# EAGLE schematic sd2snes20 (EAGLE 4.15)

## Sheet 1 of 5
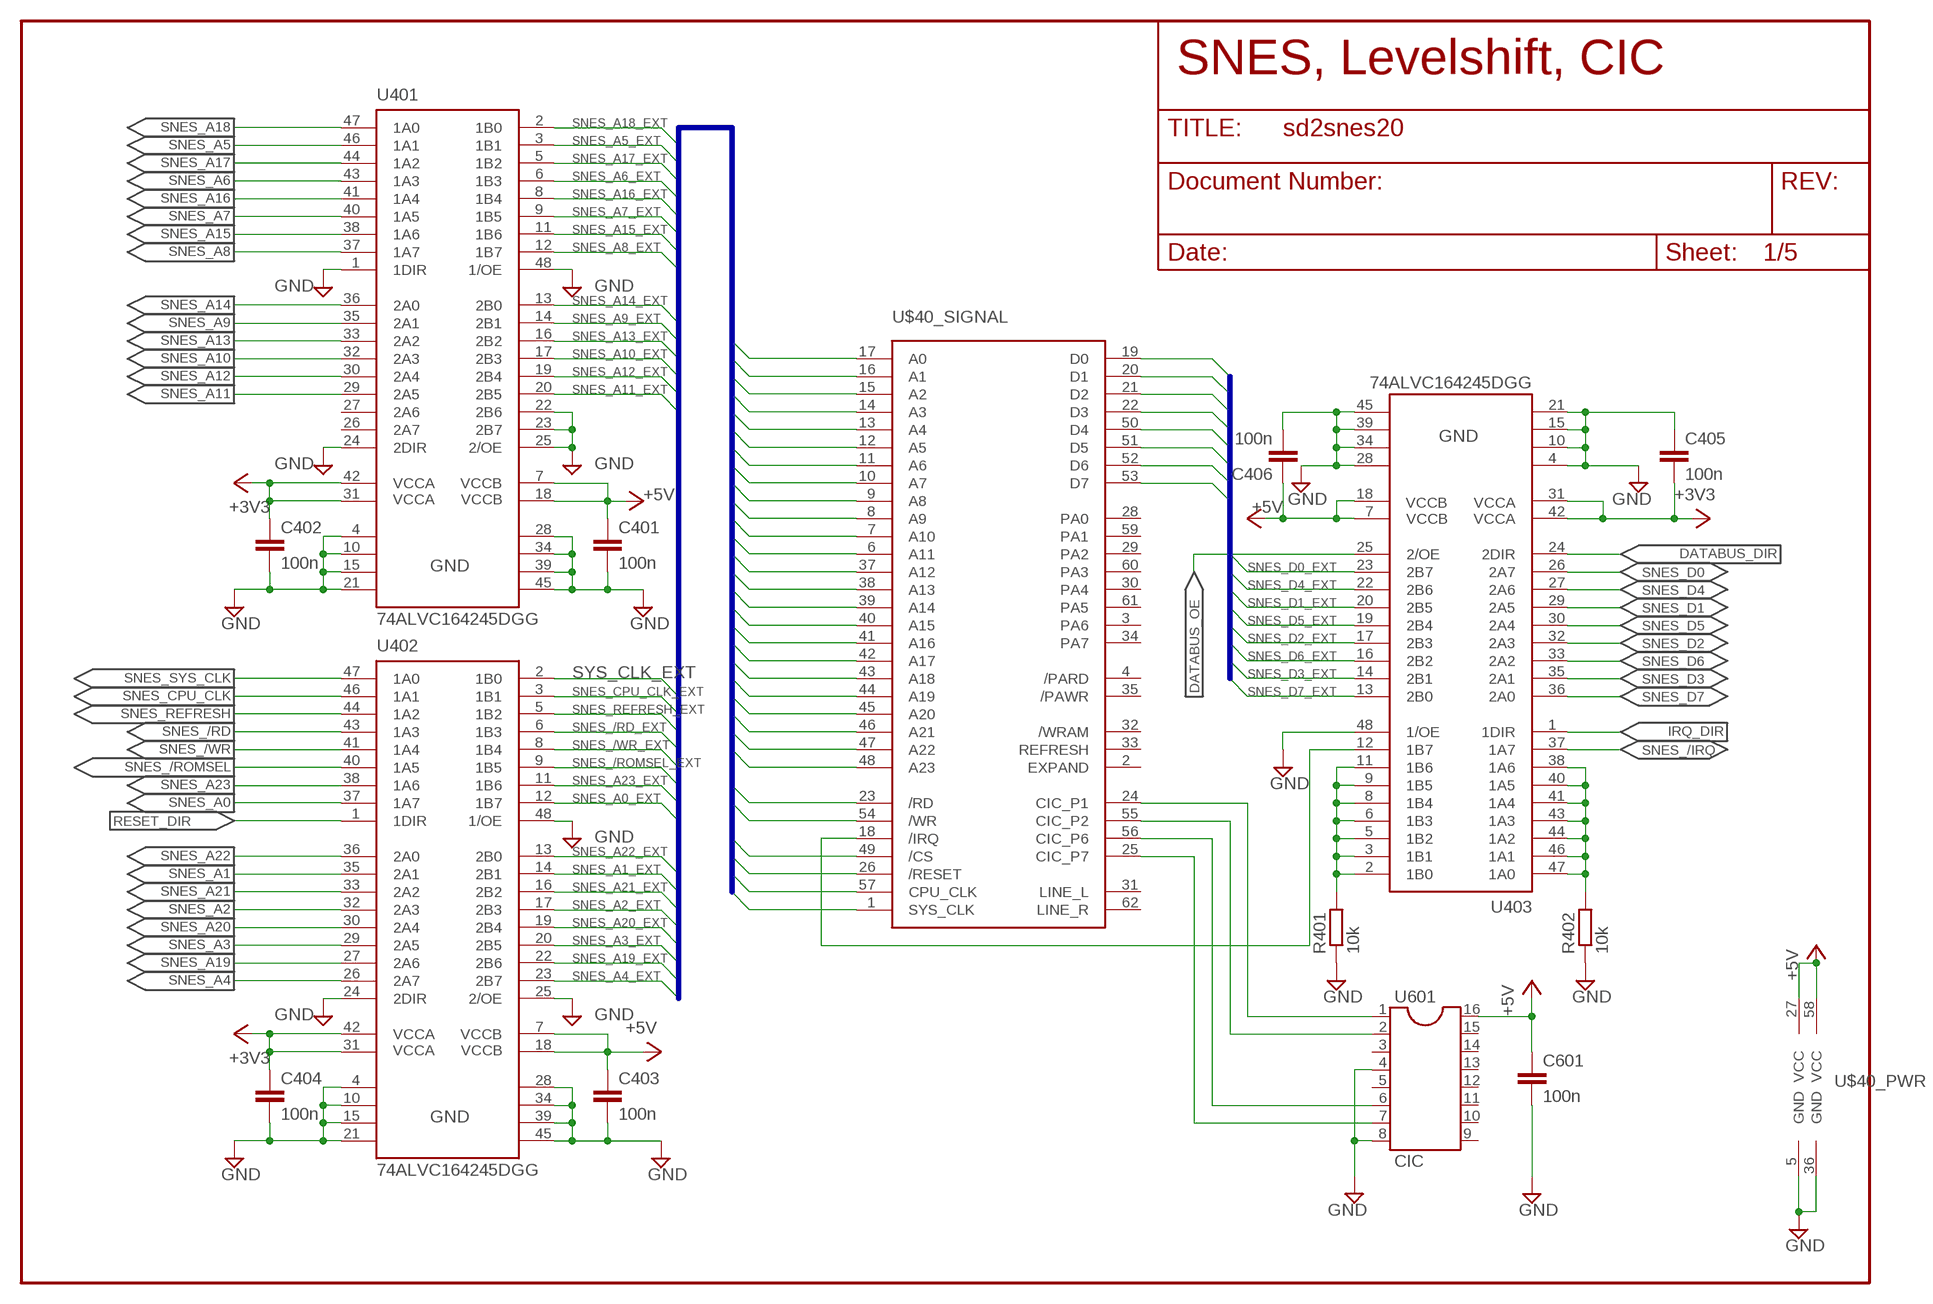
[diagram p0: schematic, sheet 1]

### Parts
C401  100n  C-EUC0805  [C0805]
C402  100n  C-EUC0805  [C0805]
C403  100n  C-EUC0805  [C0805]
C404  100n  C-EUC0805  [C0805]
C405  100n  C-EUC0805  [C0805]
C406  100n  C-EUC0805  [C0805]
C601  100n  C-EUC0805  [C0805]
R401  10k  R-EU_R0805  [R0805]
R402  10k  R-EU_R0805  [R0805]
U401  74ALVC164245DGG  [TSSOP48]
U402  74ALVC164245DGG  [TSSOP48]
U403  74ALVC164245DGG  [TSSOP48]
U601  CIC  DIL16S  [SOCKED-16]
U$40  SNESCART_EXTEDGE  [SNESCART_EXT]

### Nets
+3V3: C402.1 C404.1 C405.2 U401.31(VCCA1) U401.42(VCCA) U402.31(VCCA1) U402.42(VCCA) U403.31(VCCA1) U403.42(VCCA) ; also sheet 4
+5V: C401.1 C403.1 C406.1 C601.1 U401.7(VCCB) U401.18(VCCB1) U402.7(VCCB) U402.18(VCCB1) U403.7(VCCB) U403.18(VCCB1) U601.16 U$40.27(_PWR:VCC) U$40.58(_PWR:VCC) ; also sheet 4
GND: C401.2 C402.2 C403.2 C404.2 C405.1 C406.2 C601.2 R401.1 R402.1 U401.1(1DIR) U401.4(GND) U401.10(GND) U401.15(GND) U401.21(GND) U401.22(2B6) U401.23(2B7) U401.24(2DIR) U401.25(2/OE) U401.28(GND) U401.34(GND) U401.39(GND) U401.45(GND) U401.48(1/OE) U402.4(GND) U402.10(GND) U402.15(GND) U402.21(GND) U402.24(2DIR) U402.25(2/OE) U402.28(GND) U402.34(GND) U402.39(GND) U402.45(GND) U402.48(1/OE) U403.4(GND) U403.10(GND) U403.15(GND) U403.21(GND) U403.28(GND) U403.34(GND) U403.39(GND) U403.45(GND) U403.48(1/OE) U601.4 U601.8 U$40.5(_PWR:GND) U$40.36(_PWR:GND) ; also sheet 4
IRQ_DIR: U403.1(1DIR)
N$1: U601.1 U$40.24(_SIGNAL:CIC_P1)
N$2: U601.2 U$40.55(_SIGNAL:CIC_P2)
N$3: U601.6 U$40.56(_SIGNAL:CIC_P6)
N$4: U601.7 U$40.25(_SIGNAL:CIC_P7)
N$10: R401.2 U403.2(1B0) U403.3(1B1) U403.5(1B2) U403.6(1B3) U403.8(1B4) U403.9(1B5) U403.11(1B6)
N$12: R402.2 U403.38(1A6) U403.40(1A5) U403.41(1A4) U403.43(1A3) U403.44(1A2) U403.46(1A1) U403.47(1A0)
RESET_DIR: U402.1(1DIR) ; also sheet 4
SNES_/IRQ: U403.37(1A7)
SNES_/IRQ_EXT: U403.12(1B7) U$40.18(_SIGNAL:/IRQ)
SNES_/RD: U402.43(1A3)
SNES_/RD_EXT: U402.6(1B3) U$40.23(_SIGNAL:/RD)
SNES_/RESET_EXT: U$40.26(_SIGNAL:/RESET)
SNES_/ROMSEL: U402.40(1A5)
SNES_/ROMSEL_EXT: U402.9(1B5) U$40.49(_SIGNAL:/CS)
SNES_/WR: U402.41(1A4)
SNES_/WR_EXT: U402.8(1B4) U$40.54(_SIGNAL:/WR)
SNES_A0: U402.37(1A7)
SNES_A0_EXT: U402.12(1B7) U$40.17(_SIGNAL:A0)
SNES_A1: U402.35(2A1)
SNES_A1_EXT: U402.14(2B1) U$40.16(_SIGNAL:A1)
SNES_A2: U402.32(2A3)
SNES_A2_EXT: U402.17(2B3) U$40.15(_SIGNAL:A2)
SNES_A3: U402.29(2A5)
SNES_A3_EXT: U402.20(2B5) U$40.14(_SIGNAL:A3)
SNES_A4: U402.26(2A7)
SNES_A4_EXT: U402.23(2B7) U$40.13(_SIGNAL:A4)
SNES_A5: U401.46(1A1)
SNES_A5_EXT: U401.3(1B1) U$40.12(_SIGNAL:A5)
SNES_A6: U401.43(1A3)
SNES_A6_EXT: U401.6(1B3) U$40.11(_SIGNAL:A6)
SNES_A7: U401.40(1A5)
SNES_A7_EXT: U401.9(1B5) U$40.10(_SIGNAL:A7)
SNES_A8: U401.37(1A7)
SNES_A8_EXT: U401.12(1B7) U$40.9(_SIGNAL:A8)
SNES_A9: U401.35(2A1)
SNES_A9_EXT: U401.14(2B1) U$40.8(_SIGNAL:A9)
SNES_A10: U401.32(2A3)
SNES_A10_EXT: U401.17(2B3) U$40.7(_SIGNAL:A10)
SNES_A11: U401.29(2A5)
SNES_A11_EXT: U401.20(2B5) U$40.6(_SIGNAL:A11)
SNES_A12: U401.30(2A4)
SNES_A12_EXT: U401.19(2B4) U$40.37(_SIGNAL:A12)
SNES_A13: U401.33(2A2)
SNES_A13_EXT: U401.16(2B2) U$40.38(_SIGNAL:A13)
SNES_A14: U401.36(2A0)
SNES_A14_EXT: U401.13(2B0) U$40.39(_SIGNAL:A14)
SNES_A15: U401.38(1A6)
SNES_A15_EXT: U401.11(1B6) U$40.40(_SIGNAL:A15)
SNES_A16: U401.41(1A4)
SNES_A16_EXT: U401.8(1B4) U$40.41(_SIGNAL:A16)
SNES_A17: U401.44(1A2)
SNES_A17_EXT: U401.5(1B2) U$40.42(_SIGNAL:A17)
SNES_A18: U401.47(1A0)
SNES_A18_EXT: U401.2(1B0) U$40.43(_SIGNAL:A18)
SNES_A19: U402.27(2A6)
SNES_A19_EXT: U402.22(2B6) U$40.44(_SIGNAL:A19)
SNES_A20: U402.30(2A4)
SNES_A20_EXT: U402.19(2B4) U$40.45(_SIGNAL:A20)
SNES_A21: U402.33(2A2)
SNES_A21_EXT: U402.16(2B2) U$40.46(_SIGNAL:A21)
SNES_A22: U402.36(2A0)
SNES_A22_EXT: U402.13(2B0) U$40.47(_SIGNAL:A22)
SNES_A23: U402.38(1A6)
SNES_A23_EXT: U402.11(1B6) U$40.48(_SIGNAL:A23)
SNES_CPU_CLK: U402.46(1A1)
SNES_CPU_CLK_EXT: U402.3(1B1) U$40.57(_SIGNAL:CPU_CLK)
SNES_D0: U403.26(2A7)
SNES_D0_EXT: U403.23(2B7) U$40.19(_SIGNAL:D0)
SNES_D1: U403.29(2A5)
SNES_D1_EXT: U403.20(2B5) U$40.20(_SIGNAL:D1)
SNES_D2: U403.32(2A3)
SNES_D2_EXT: U403.17(2B3) U$40.21(_SIGNAL:D2)
SNES_D3: U403.35(2A1)
SNES_D3_EXT: U403.14(2B1) U$40.22(_SIGNAL:D3)
SNES_D4: U403.27(2A6)
SNES_D4_EXT: U403.22(2B6) U$40.50(_SIGNAL:D4)
SNES_D5: U403.30(2A4)
SNES_D5_EXT: U403.19(2B4) U$40.51(_SIGNAL:D5)
SNES_D6: U403.33(2A2)
SNES_D6_EXT: U403.16(2B2) U$40.52(_SIGNAL:D6)
SNES_D7: U403.36(2A0)
SNES_D7_EXT: U403.13(2B0) U$40.53(_SIGNAL:D7)
SNES_DATABUS_/OE: U403.25(2/OE)
SNES_DATABUS_DIR: U403.24(2DIR)
SNES_REFRESH: U402.44(1A2)
SNES_REFRESH_EXT: U402.5(1B2)
SNES_SYS_CLK: U402.47(1A0)
SYS_CLK_EXT: U402.2(1B0) U$40.1(_SIGNAL:SYS_CLK)
Unconnected: U401.26(2A7) U401.27(2A6) U601.3 U601.5 U601.9 U601.10 U601.11 U601.12 U601.13 U601.14 U601.15 U$40.2(_SIGNAL:EXPAND) U$40.3(_SIGNAL:PA6) U$40.4(_SIGNAL:/PARD) U$40.28(_SIGNAL:PA0) U$40.29(_SIGNAL:PA2) U$40.30(_SIGNAL:PA4) U$40.31(_SIGNAL:LINE_L) U$40.32(_SIGNAL:/WRAM) U$40.33(_SIGNAL:REFRESH) U$40.34(_SIGNAL:PA7) U$40.35(_SIGNAL:/PAWR) U$40.59(_SIGNAL:PA1) U$40.60(_SIGNAL:PA3) U$40.61(_SIGNAL:PA5) U$40.62(_SIGNAL:LINE_R)

### Buses
B$1
B$2

### Notes on the sheet
- SNES, Levelshift, CIC

## Sheet 2 of 5
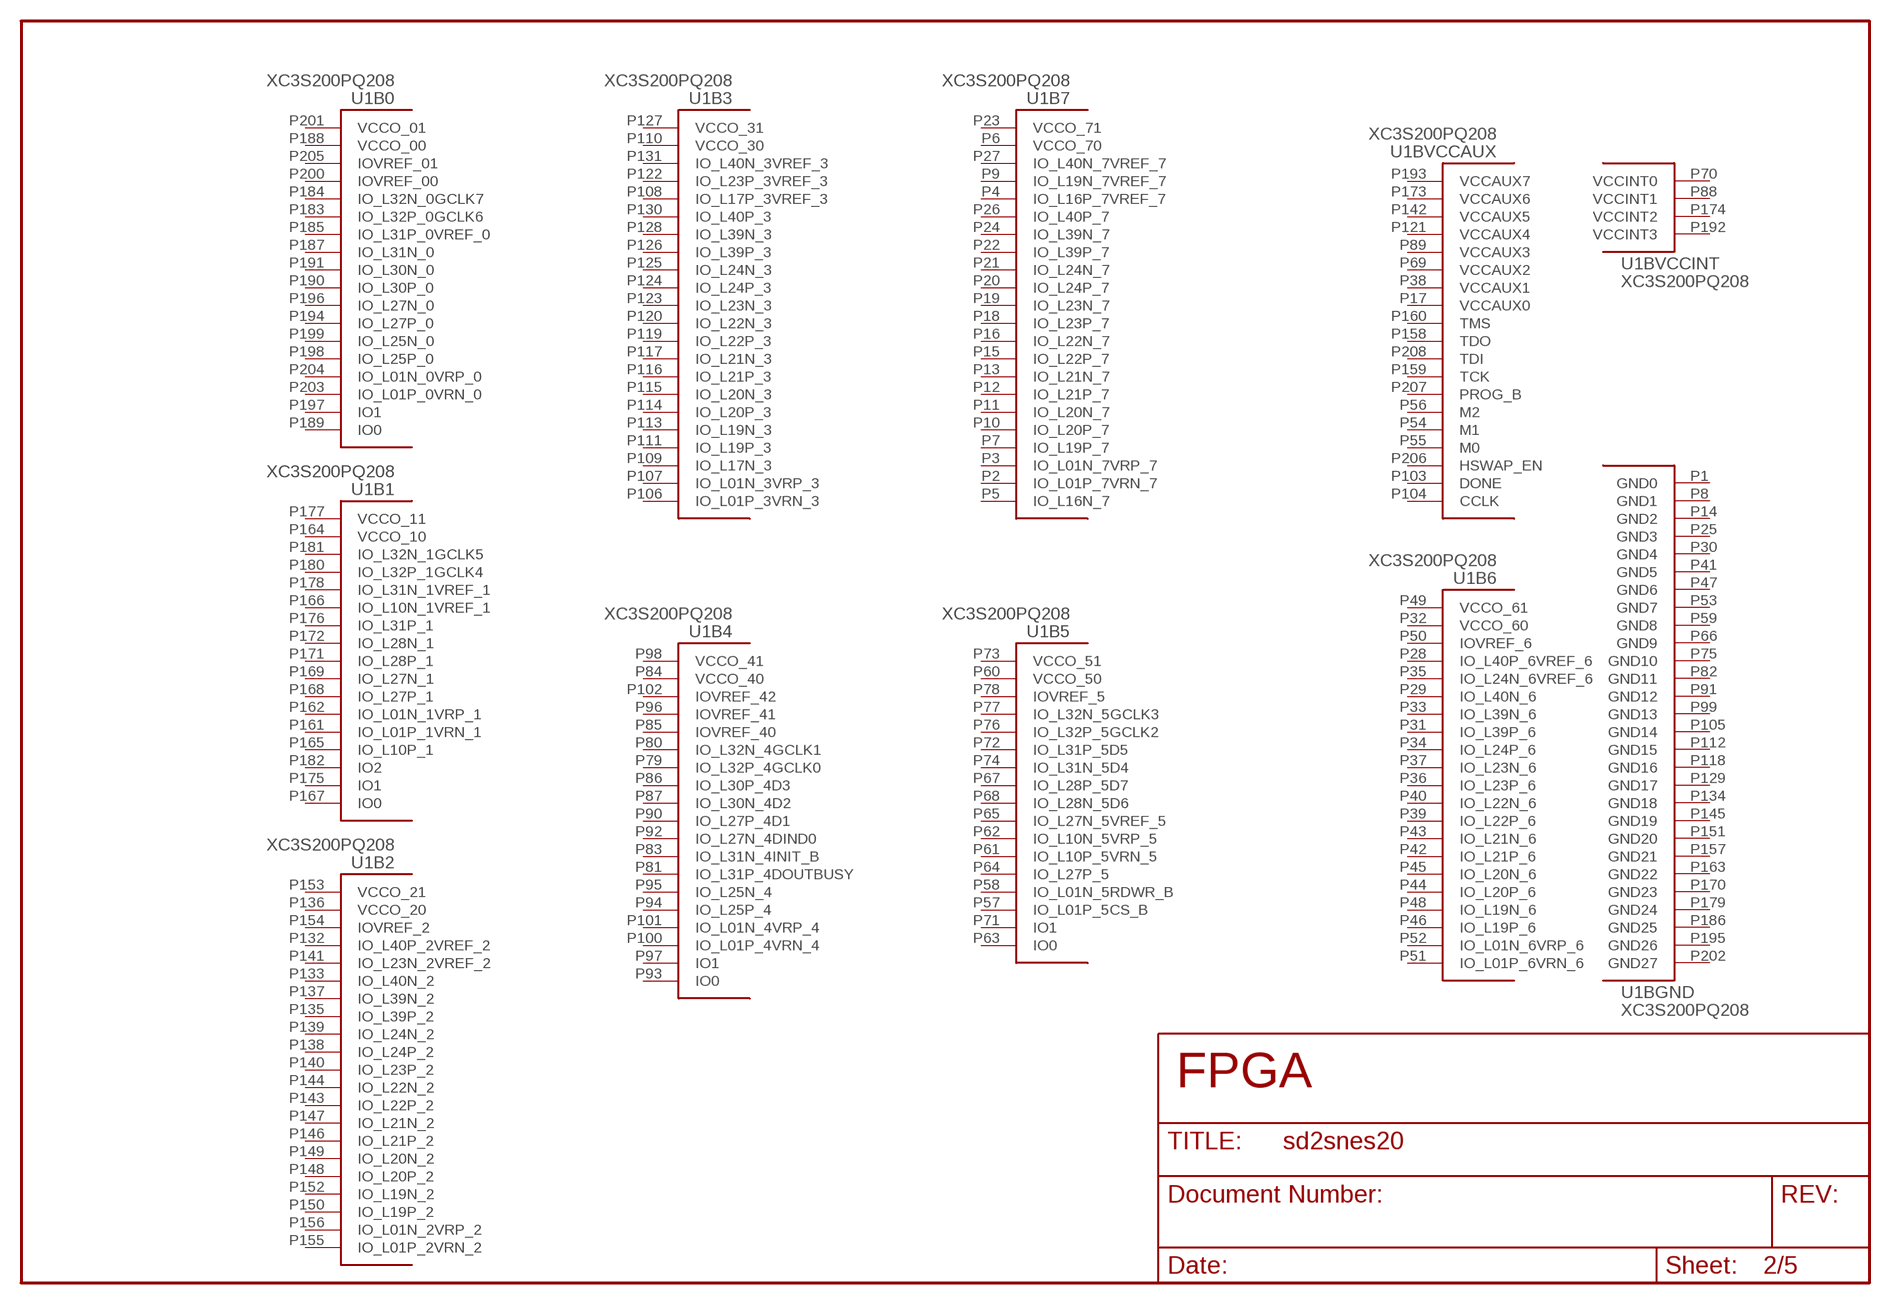
[diagram p1: schematic, sheet 2]

### Parts
U1  XC3S200PQ208  [PQ208]
Unconnected: U1.P1(BGND:GND0) U1.P2(B7:IO_L01P_7VRN_7) U1.P3(B7:IO_L01N_7VRP_7) U1.P4(B7:IO_L16P_7VREF_7) U1.P5(B7:IO_L16N_7) U1.P6(B7:VCCO_70) U1.P7(B7:IO_L19P_7) U1.P8(BGND:GND1) U1.P9(B7:IO_L19N_7VREF_7) U1.P10(B7:IO_L20P_7) U1.P11(B7:IO_L20N_7) U1.P12(B7:IO_L21P_7) U1.P13(B7:IO_L21N_7) U1.P14(BGND:GND2) U1.P15(B7:IO_L22P_7) U1.P16(B7:IO_L22N_7) U1.P17(BVCCAUX:VCCAUX0) U1.P18(B7:IO_L23P_7) U1.P19(B7:IO_L23N_7) U1.P20(B7:IO_L24P_7) U1.P21(B7:IO_L24N_7) U1.P22(B7:IO_L39P_7) U1.P23(B7:VCCO_71) U1.P24(B7:IO_L39N_7) U1.P25(BGND:GND3) U1.P26(B7:IO_L40P_7) U1.P27(B7:IO_L40N_7VREF_7) U1.P28(B6:IO_L40P_6VREF_6) U1.P29(B6:IO_L40N_6) U1.P30(BGND:GND4) U1.P31(B6:IO_L39P_6) U1.P32(B6:VCCO_60) U1.P33(B6:IO_L39N_6) U1.P34(B6:IO_L24P_6) U1.P35(B6:IO_L24N_6VREF_6) U1.P36(B6:IO_L23P_6) U1.P37(B6:IO_L23N_6) U1.P38(BVCCAUX:VCCAUX1) U1.P39(B6:IO_L22P_6) U1.P40(B6:IO_L22N_6) U1.P41(BGND:GND5) U1.P42(B6:IO_L21P_6) U1.P43(B6:IO_L21N_6) U1.P44(B6:IO_L20P_6) U1.P45(B6:IO_L20N_6) U1.P46(B6:IO_L19P_6) U1.P47(BGND:GND6) U1.P48(B6:IO_L19N_6) U1.P49(B6:VCCO_61) U1.P50(B6:IOVREF_6) U1.P51(B6:IO_L01P_6VRN_6) U1.P52(B6:IO_L01N_6VRP_6) U1.P53(BGND:GND7) U1.P54(BVCCAUX:M1) U1.P55(BVCCAUX:M0) U1.P56(BVCCAUX:M2) U1.P57(B5:IO_L01P_5CS_B) U1.P58(B5:IO_L01N_5RDWR_B) U1.P59(BGND:GND8) U1.P60(B5:VCCO_50) U1.P61(B5:IO_L10P_5VRN_5) U1.P62(B5:IO_L10N_5VRP_5) U1.P63(B5:IO0) U1.P64(B5:IO_L27P_5) U1.P65(B5:IO_L27N_5VREF_5) U1.P66(BGND:GND9) U1.P67(B5:IO_L28P_5D7) U1.P68(B5:IO_L28N_5D6) U1.P69(BVCCAUX:VCCAUX2) U1.P70(BVCCINT:VCCINT0) U1.P71(B5:IO1) U1.P72(B5:IO_L31P_5D5) U1.P73(B5:VCCO_51) U1.P74(B5:IO_L31N_5D4) U1.P75(BGND:GND10) U1.P76(B5:IO_L32P_5GCLK2) U1.P77(B5:IO_L32N_5GCLK3) U1.P78(B5:IOVREF_5) U1.P79(B4:IO_L32P_4GCLK0) U1.P80(B4:IO_L32N_4GCLK1) U1.P81(B4:IO_L31P_4DOUTBUSY) U1.P82(BGND:GND11) U1.P83(B4:IO_L31N_4INIT_B) U1.P84(B4:VCCO_40) U1.P85(B4:IOVREF_40) U1.P86(B4:IO_L30P_4D3) U1.P87(B4:IO_L30N_4D2) U1.P88(BVCCINT:VCCINT1) U1.P89(BVCCAUX:VCCAUX3) U1.P90(B4:IO_L27P_4D1) U1.P91(BGND:GND12) U1.P92(B4:IO_L27N_4DIND0) U1.P93(B4:IO0) U1.P94(B4:IO_L25P_4) U1.P95(B4:IO_L25N_4) U1.P96(B4:IOVREF_41) U1.P97(B4:IO1) U1.P98(B4:VCCO_41) U1.P99(BGND:GND13) U1.P100(B4:IO_L01P_4VRN_4) U1.P101(B4:IO_L01N_4VRP_4) U1.P102(B4:IOVREF_42) U1.P103(BVCCAUX:DONE) U1.P104(BVCCAUX:CCLK) U1.P105(BGND:GND14) U1.P106(B3:IO_L01P_3VRN_3) U1.P107(B3:IO_L01N_3VRP_3) U1.P108(B3:IO_L17P_3VREF_3) U1.P109(B3:IO_L17N_3) U1.P110(B3:VCCO_30) U1.P111(B3:IO_L19P_3) U1.P112(BGND:GND15) U1.P113(B3:IO_L19N_3) U1.P114(B3:IO_L20P_3) U1.P115(B3:IO_L20N_3) U1.P116(B3:IO_L21P_3) U1.P117(B3:IO_L21N_3) U1.P118(BGND:GND16) U1.P119(B3:IO_L22P_3) U1.P120(B3:IO_L22N_3) U1.P121(BVCCAUX:VCCAUX4) U1.P122(B3:IO_L23P_3VREF_3) U1.P123(B3:IO_L23N_3) U1.P124(B3:IO_L24P_3) U1.P125(B3:IO_L24N_3) U1.P126(B3:IO_L39P_3) U1.P127(B3:VCCO_31) U1.P128(B3:IO_L39N_3) U1.P129(BGND:GND17) U1.P130(B3:IO_L40P_3) U1.P131(B3:IO_L40N_3VREF_3) U1.P132(B2:IO_L40P_2VREF_2) U1.P133(B2:IO_L40N_2) U1.P134(BGND:GND18) U1.P135(B2:IO_L39P_2) U1.P136(B2:VCCO_20) U1.P137(B2:IO_L39N_2) U1.P138(B2:IO_L24P_2) U1.P139(B2:IO_L24N_2) U1.P140(B2:IO_L23P_2) U1.P141(B2:IO_L23N_2VREF_2) U1.P142(BVCCAUX:VCCAUX5) U1.P143(B2:IO_L22P_2) U1.P144(B2:IO_L22N_2) U1.P145(BGND:GND19) U1.P146(B2:IO_L21P_2) U1.P147(B2:IO_L21N_2) U1.P148(B2:IO_L20P_2) U1.P149(B2:IO_L20N_2) U1.P150(B2:IO_L19P_2) U1.P151(BGND:GND20) U1.P152(B2:IO_L19N_2) U1.P153(B2:VCCO_21) U1.P154(B2:IOVREF_2) U1.P155(B2:IO_L01P_2VRN_2) U1.P156(B2:IO_L01N_2VRP_2) U1.P157(BGND:GND21) U1.P158(BVCCAUX:TDO) U1.P159(BVCCAUX:TCK) U1.P160(BVCCAUX:TMS) U1.P161(B1:IO_L01P_1VRN_1) U1.P162(B1:IO_L01N_1VRP_1) U1.P163(BGND:GND22) U1.P164(B1:VCCO_10) U1.P165(B1:IO_L10P_1) U1.P166(B1:IO_L10N_1VREF_1) U1.P167(B1:IO0) U1.P168(B1:IO_L27P_1) U1.P169(B1:IO_L27N_1) U1.P170(BGND:GND23) U1.P171(B1:IO_L28P_1) U1.P172(B1:IO_L28N_1) U1.P173(BVCCAUX:VCCAUX6) U1.P174(BVCCINT:VCCINT2) U1.P175(B1:IO1) U1.P176(B1:IO_L31P_1) U1.P177(B1:VCCO_11) U1.P178(B1:IO_L31N_1VREF_1) U1.P179(BGND:GND24) U1.P180(B1:IO_L32P_1GCLK4) U1.P181(B1:IO_L32N_1GCLK5) U1.P182(B1:IO2) U1.P183(B0:IO_L32P_0GCLK6) U1.P184(B0:IO_L32N_0GCLK7) U1.P185(B0:IO_L31P_0VREF_0) U1.P186(BGND:GND25) U1.P187(B0:IO_L31N_0) U1.P188(B0:VCCO_00) U1.P189(B0:IO0) U1.P190(B0:IO_L30P_0) U1.P191(B0:IO_L30N_0) U1.P192(BVCCINT:VCCINT3) U1.P193(BVCCAUX:VCCAUX7) U1.P194(B0:IO_L27P_0) U1.P195(BGND:GND26) U1.P196(B0:IO_L27N_0) U1.P197(B0:IO1) U1.P198(B0:IO_L25P_0) U1.P199(B0:IO_L25N_0) U1.P200(B0:IOVREF_00) U1.P201(B0:VCCO_01) U1.P202(BGND:GND27) U1.P203(B0:IO_L01P_0VRN_0) U1.P204(B0:IO_L01N_0VRP_0) U1.P205(B0:IOVREF_01) U1.P206(BVCCAUX:HSWAP_EN) U1.P207(BVCCAUX:PROG_B) U1.P208(BVCCAUX:TDI)

### Notes on the sheet
- FPGA

## Sheet 3 of 5
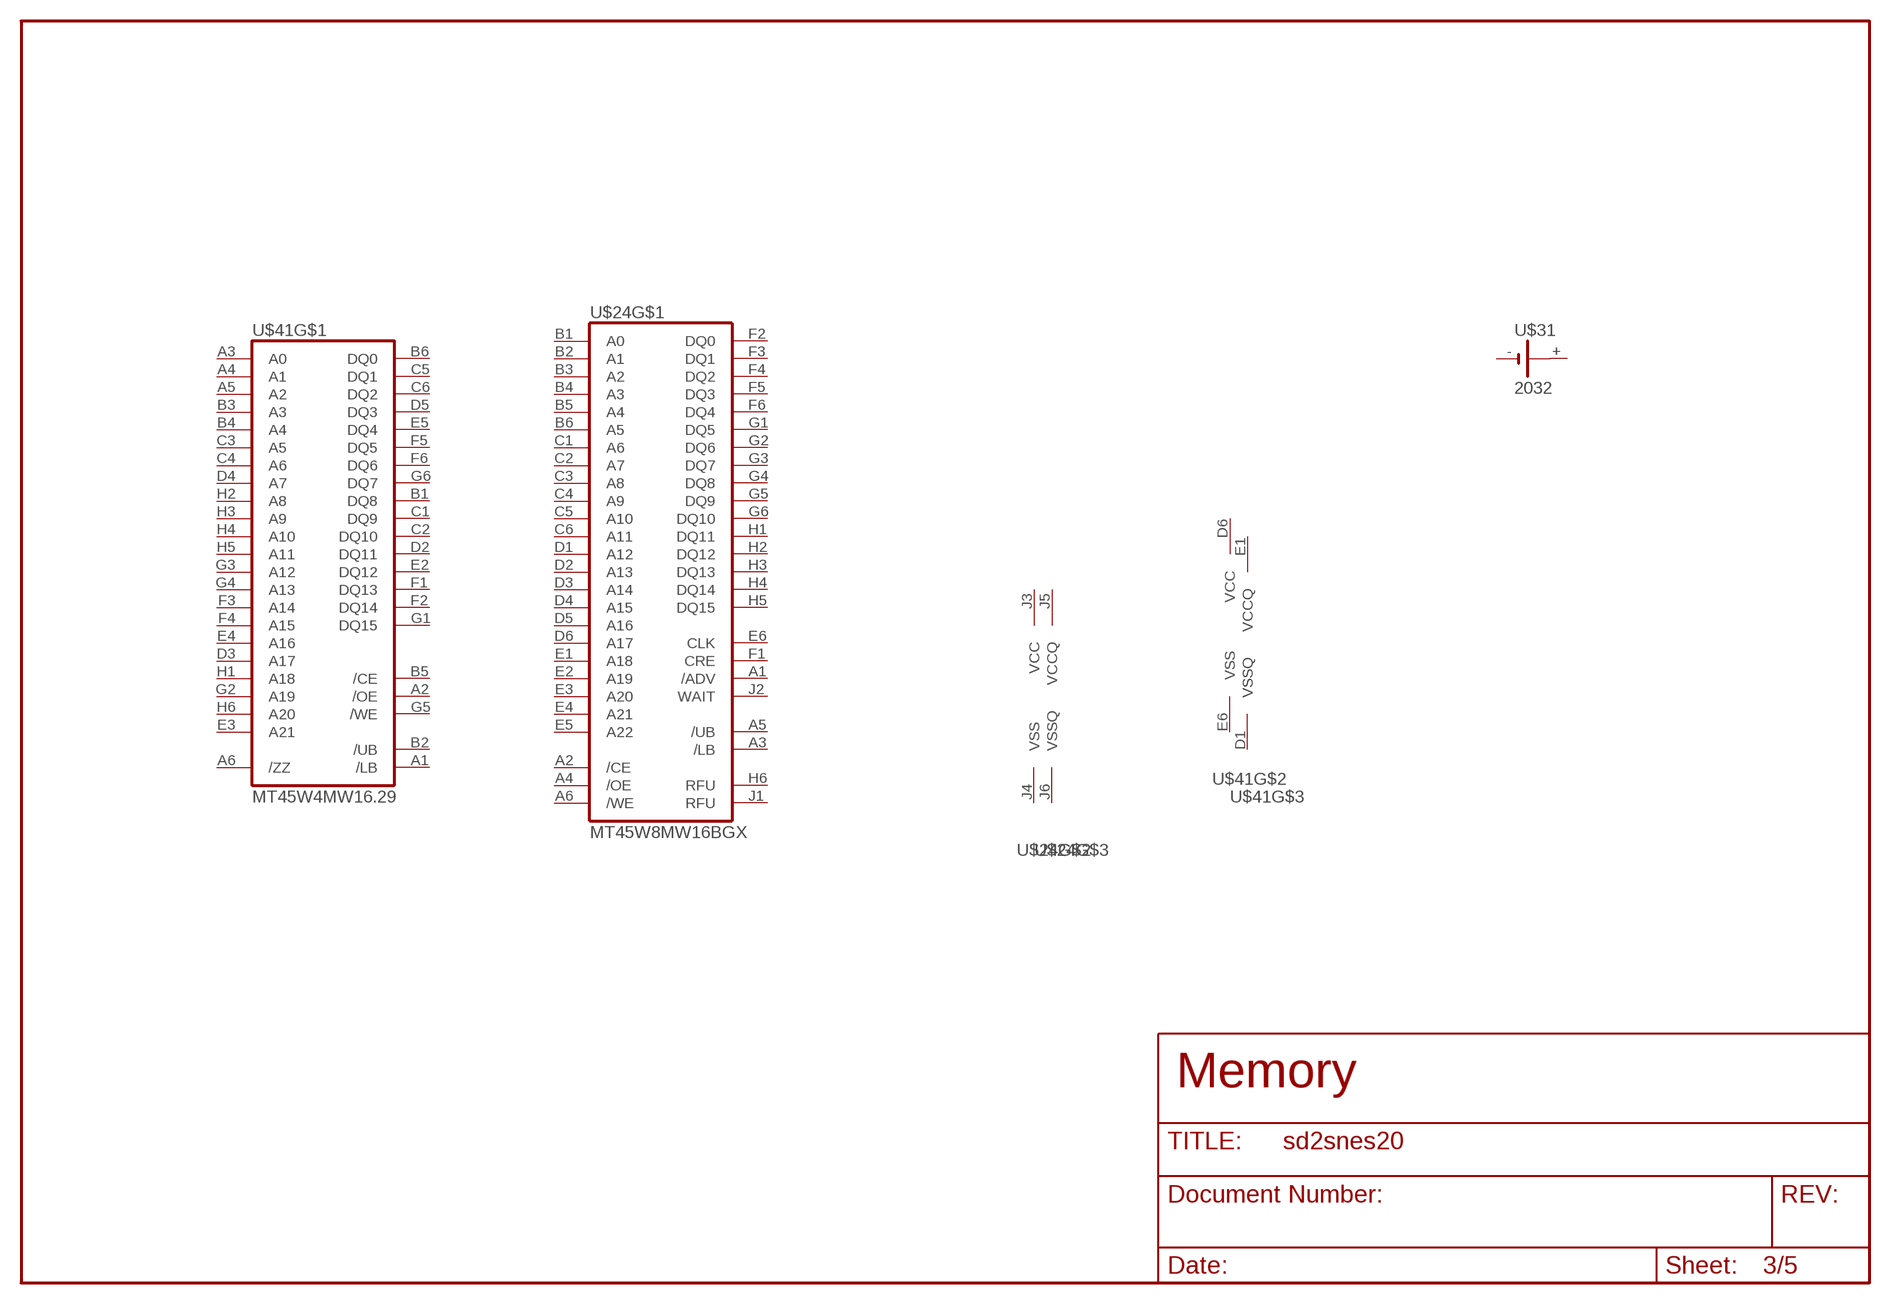
[diagram p2: schematic, sheet 3]

### Parts
U$24  MT45W8MW16BGX  [VFBGA54]
U$31  2032  [KZH20SMD]
U$41  MT45W4MW16.29  [VFBGA48-.29]
Unconnected: U$24.A1(/ADV) U$24.A2(/CE) U$24.A3(/LB) U$24.A4(/OE) U$24.A5(/UB) U$24.A6(/WE) U$24.B1(A0) U$24.B2(A1) U$24.B3(A2) U$24.B4(A3) U$24.B5(A4) U$24.B6(A5) U$24.C1(A6) U$24.C2(A7) U$24.C3(A8) U$24.C4(A9) U$24.C5(A10) U$24.C6(A11) U$24.D1(A12) U$24.D2(A13) U$24.D3(A14) U$24.D4(A15) U$24.D5(A16) U$24.D6(A17) U$24.E1(A18) U$24.E2(A19) U$24.E3(A20) U$24.E4(A21) U$24.E5(A22) U$24.E6(CLK) U$24.F1(CRE) U$24.F2(DQ0) U$24.F3(DQ1) U$24.F4(DQ2) U$24.F5(DQ3) U$24.F6(DQ4) U$24.G1(DQ5) U$24.G2(DQ6) U$24.G3(DQ7) U$24.G4(DQ8) U$24.G5(DQ9) U$24.G6(DQ10) U$24.H1(DQ11) U$24.H2(DQ12) U$24.H3(DQ13) U$24.H4(DQ14) U$24.H5(DQ15) U$24.H6(RFU) U$24.J1(RFU) U$24.J2(WAIT) U$24.J3(VCC) U$24.J4(VSS) U$24.J5(VCCQ) U$24.J6(VSSQ) U$31.+ U$31.- U$41.A1(/LB) U$41.A2(/OE) U$41.A3(A0) U$41.A4(A1) U$41.A5(A2) U$41.A6(/ZZ) U$41.B1(DQ8) U$41.B2(/UB) U$41.B3(A3) U$41.B4(A4) U$41.B5(/CE) U$41.B6(DQ0) U$41.C1(DQ9) U$41.C2(DQ10) U$41.C3(A5) U$41.C4(A6) U$41.C5(DQ1) U$41.C6(DQ2) U$41.D1(VSSQ) U$41.D2(DQ11) U$41.D3(A17) U$41.D4(A7) U$41.D5(DQ3) U$41.D6(VCC) U$41.E1(VCCQ) U$41.E2(DQ12) U$41.E3(A21) U$41.E4(A16) U$41.E5(DQ4) U$41.E6(VSS) U$41.F1(DQ13) U$41.F2(DQ14) U$41.F3(A14) U$41.F4(A15) U$41.F5(DQ5) U$41.F6(DQ6) U$41.G1(DQ15) U$41.G2(A19) U$41.G3(A12) U$41.G4(A13) U$41.G5(/WE) U$41.G6(DQ7) U$41.H1(A18) U$41.H2(A8) U$41.H3(A9) U$41.H4(A10) U$41.H5(A11) U$41.H6(A20)

### Notes on the sheet
- Memory

## Sheet 4 of 5
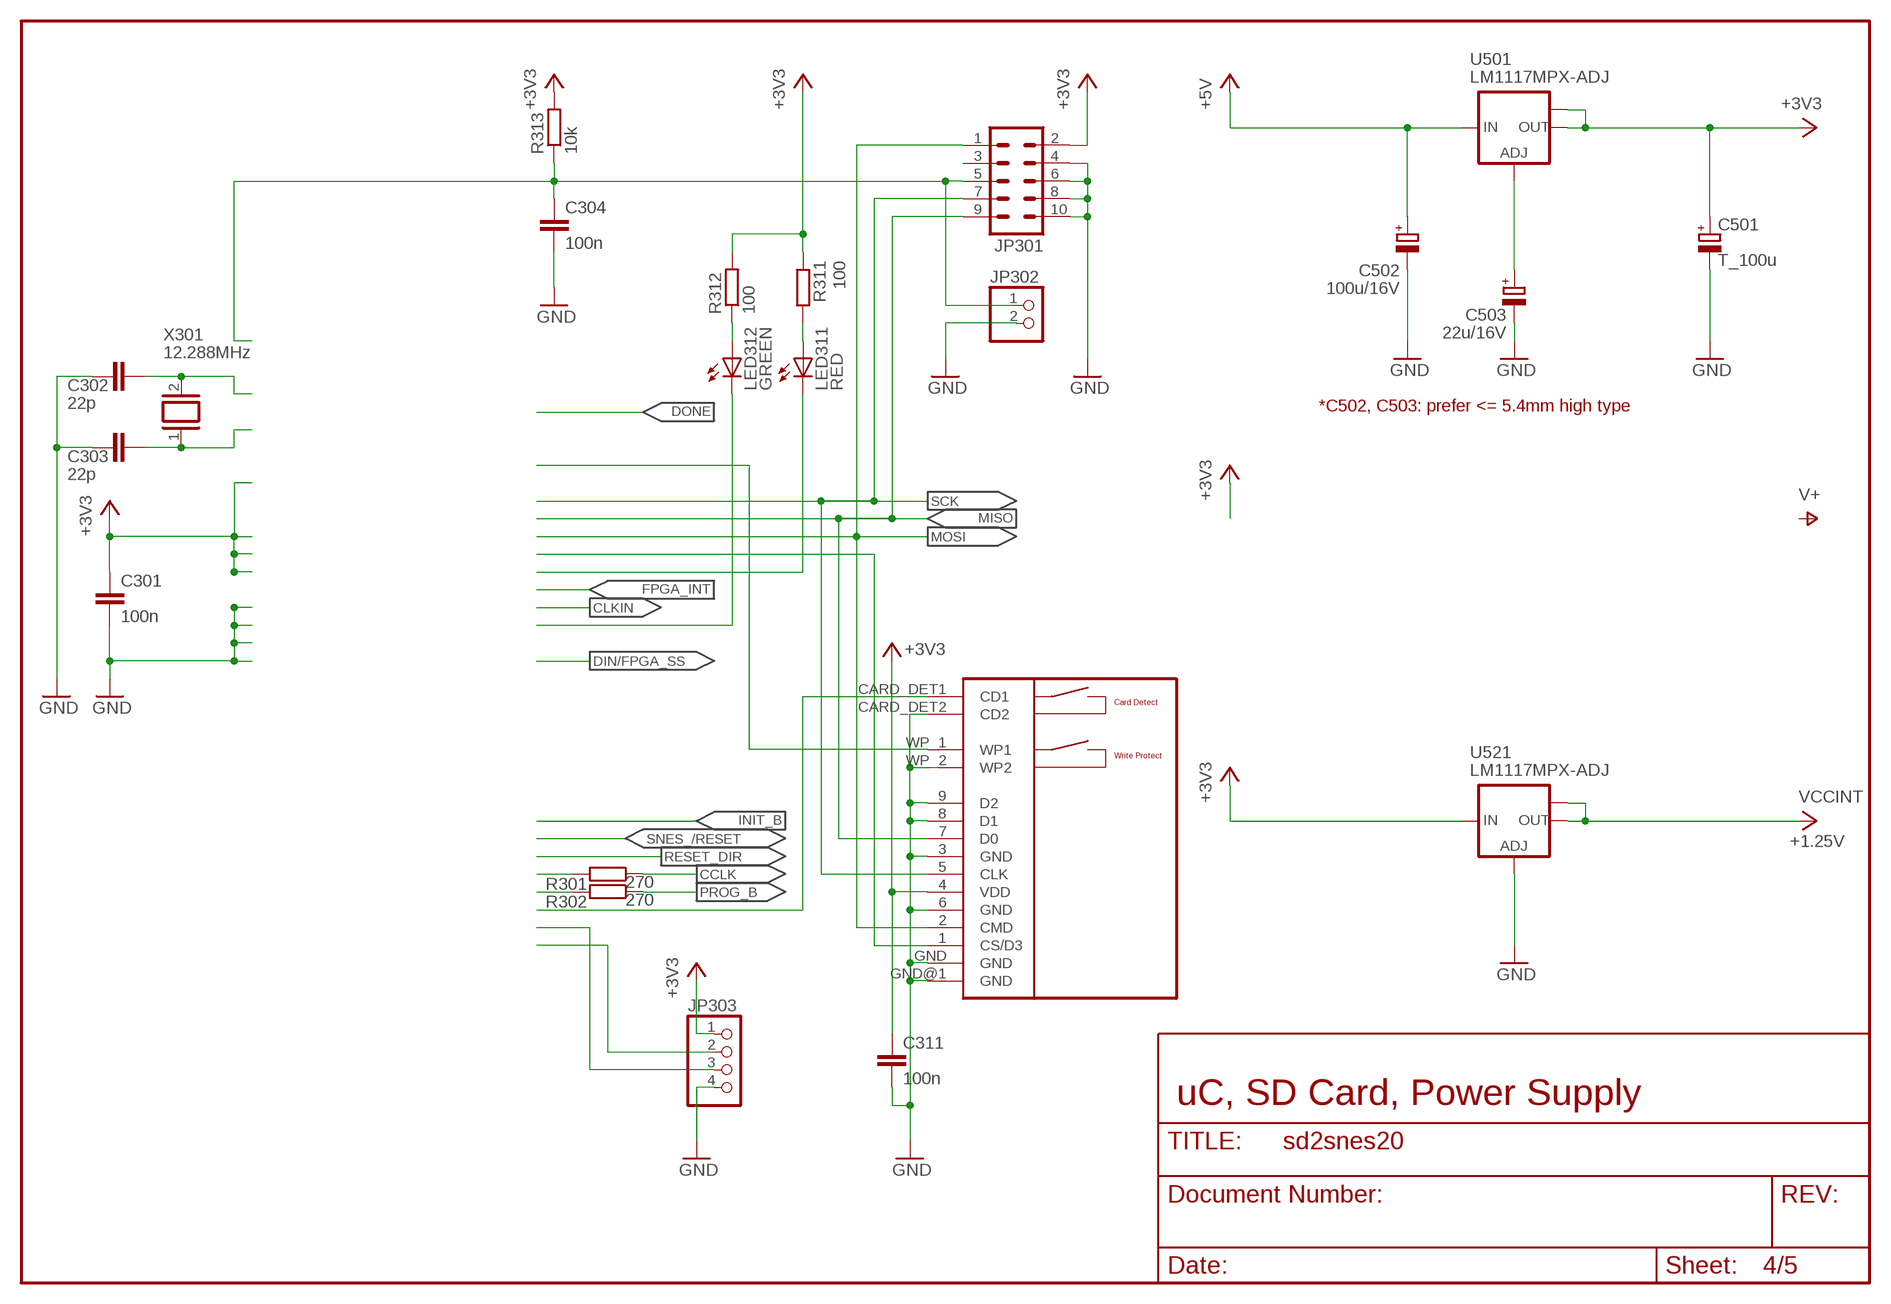
[diagram p3: schematic, sheet 4]

### Parts
C301  100n  C-EUC0805  [C0805]
C302  22p  C-EUC0805  [C0805]
C303  22p  C-EUC0805  [C0805]
C304  100n  C-EUC0805  [C0805]
C311  100n  C-EUC0805  [C0805]
C501  T_100u  CPOL-EUSMCD  [SMC_D]
C502  100u/16V  CPOL-EUD  [PANASONIC_D]
C503  22u/16V  CPOL-EUC  [PANASONIC_C]
J301  JAE-SG5S009V1A  [JAE-SG5S009V1A]
JP301  MA05-2  [MA05-2]
JP302  PINHD-1X2  [1X02]
JP303  PINHD-1X4  [1X04]
LED311  RED  LEDCHIPLED_0805  [CHIPLED_0805]
LED312  GREEN  LEDCHIPLED_0805  [CHIPLED_0805]
R301  270  R-EU_R0805  [R0805]
R302  270  R-EU_R0805  [R0805]
R311  100  R-EU_R0805  [R0805]
R312  100  R-EU_R0805  [R0805]
R313  10k  R-EU_R0805  [R0805]
U501  LM1117MPX-ADJ  [SOT223]
U521  LM1117MPX-ADJ  [SOT223]
X301  12.288MHz  XTAL/S  [QS]

### Nets
+1.25V: U521.2(OUT) U521.TAB(OUT1) ; supply symbol labelled VCCINT
+3V3: C301.1 C311.1 C501.+ J301.4(VDD) JP301.2 JP303.1 R311.1 R312.2 R313.2 U501.2(OUT) U501.TAB(OUT1) U521.3(IN) ; also sheet 1
+5V: C502.+ U501.3(IN) ; also sheet 1
CCLK: R301.1
CCLK_AVR: R301.2
GND: C301.2 C302.1 C303.1 C304.2 C311.2 C501.- C502.- C503.- J301.3(GND) J301.6(GND) J301.8(D1) J301.9(D2) J301.CARD_DET2(CD2) J301.GND J301.GND@1(GND) J301.WP_2(WP2) JP301.4 JP301.6 JP301.8 JP301.10 JP302.2 JP303.4 U521.1(ADJ) ; also sheet 1
MISO: J301.7(D0) JP301.9
MOSI: J301.2(CMD) JP301.1
N$5: C302.2 X301.2
N$6: C303.2 X301.1
N$7: LED311.A R311.2
N$8: C304.1 JP301.5 JP302.1 R313.1
N$9: LED312.A R312.1
N$11: LED312.C
N$13: J301.WP_1(WP1)
N$14: LED311.C
N$108: C503.+ U501.1(ADJ)
PROG_B: R302.1
PROG_B_AVR: R302.2
RXD: JP303.2
SCK: J301.5(CLK) JP301.7
SD_DET: J301.CARD_DET1(CD1)
SD_SS: J301.1(CS/D3)
TXD: JP303.3
Unconnected: JP301.3

### Notes on the sheet
- *C502, C503: prefer <= 5.4mm high type
- uC, SD Card, Power Supply

## Sheet 5 of 5
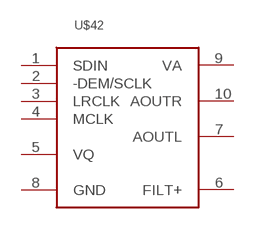
[diagram p4: schematic, sheet 5]

### Parts
U$42  CS4344  [MSOP10]
Unconnected: U$42.1(SDIN) U$42.2(-DEM/SCLK) U$42.3(LRCLK) U$42.4(MCLK) U$42.5(VQ) U$42.6(FILT+) U$42.7(AOUTL) U$42.10(AOUTR)

## Power pins joined to a net without a drawn wire
GND: U$42.8(GND)
VA: U$42.9(VA)

## Library data of the parts
C301-C304 C311 C401-C406 C601 = rcl:C-EU: CAPACITOR, European symbol
C501-C503 = rcl:CPOL-EU: POLARIZED CAPACITOR, European symbol
J301 = sdcard:JAE-SG5S009V1A
JP301 = con-lstb:MA05-2: PIN HEADER
JP302 = pinhead:PINHD-1X2: PIN HEADER
JP303 = pinhead:PINHD-1X4: PIN HEADER
LED311 LED312 = led:LED: LED OSRAM: - CHIPLED LG R971, LG N971, LY N971, LG Q971, LY Q971, LO R971, LY R971 LH N974, LH R974 LS Q976, LO Q976, LY Q976 LO Q996 - Hyper CHIPLED LW Q18S LB Q993, LB Q99A, LB R99A - SideLED LS A670, LO A670, LY A670, LG A670, LP A670 LB A673, LV A673, LT A673, LW A673 LH A674 LY A675 LS A676, LA A676, LO A676, LY A676, LW A676 LS A679, LY A679, LG A679 - Hyper Micro SIDELED® LS Y876, LA Y876, LO Y876, LY Y876 LT Y87S - SmartLED LW L88C, LW L88S LB L89C, LB L89S, LG L890 LS L89K, LO L89K, LY L89K LS L896, LA L896, LO L896, LY L896 - TOPLED LS T670, LO T670, LY T670, LG T670, LP T670 LSG T670, LSP T670, LSY T670, LOP T670, LYG T670 LG T671, LOG T671, LSG T671 LB T673, LV T673, LT T673, LW T673 LH T674 LS T676, LA T676, LO T676, LY T676, LB T676, LH T676, LSB T676, LW T676 LB T67C, LV T67C, LT T67C, LS T67K, LO T67K, LY T67K, LW E67C LS E67B, LA E67B, LO E67B, LY E67B, LB E67C, LV E67C, LT E67C LW T67C LS T679, LY T679, LG T679 LS T770, LO T770, LY T770, LG T770, LP T770 LB T773, LV T773, LT T773, LW T773 LH T774 LS E675, LA E675, LY E675, LS T675 LS T776, LA T776, LO T776, LY T776, LB T776 LHGB T686 LT T68C, LB T68C - Hyper Mini TOPLED® LB M676 - Mini TOPLED Santana® LG M470 LS M47K, LO M47K, LY M47K Source: http://www.osram.convergy.de/
R301 R302 R311-R313 R401 R402 = rcl:R-EU_: RESISTOR, European symbol
U1 = xilinx_spartan3_virtex4_and_5:XC3S200PQ208: Xilinx FPGA
U401-U403 = misc-74:74ALVC164245
U501 U521 = lm1117:LM1117MPX-ADJ
U601 = ic-package:DIL16: Dual In Line
U$24 = psram-micron:MT45W8MW16BGX
U$31 = kzh20_lithium_batterie_holder:2032
U$40 = snescart:SNESCART_EXT
U$41 = psram-micron:MT45W4MW16
U$42 = cirrus-3:CS4344
X301 = special:XTAL/S: CRYSTAL